# EAGLE design fascia_faceInterfaceV0.1 (EAGLE 9.6.0)
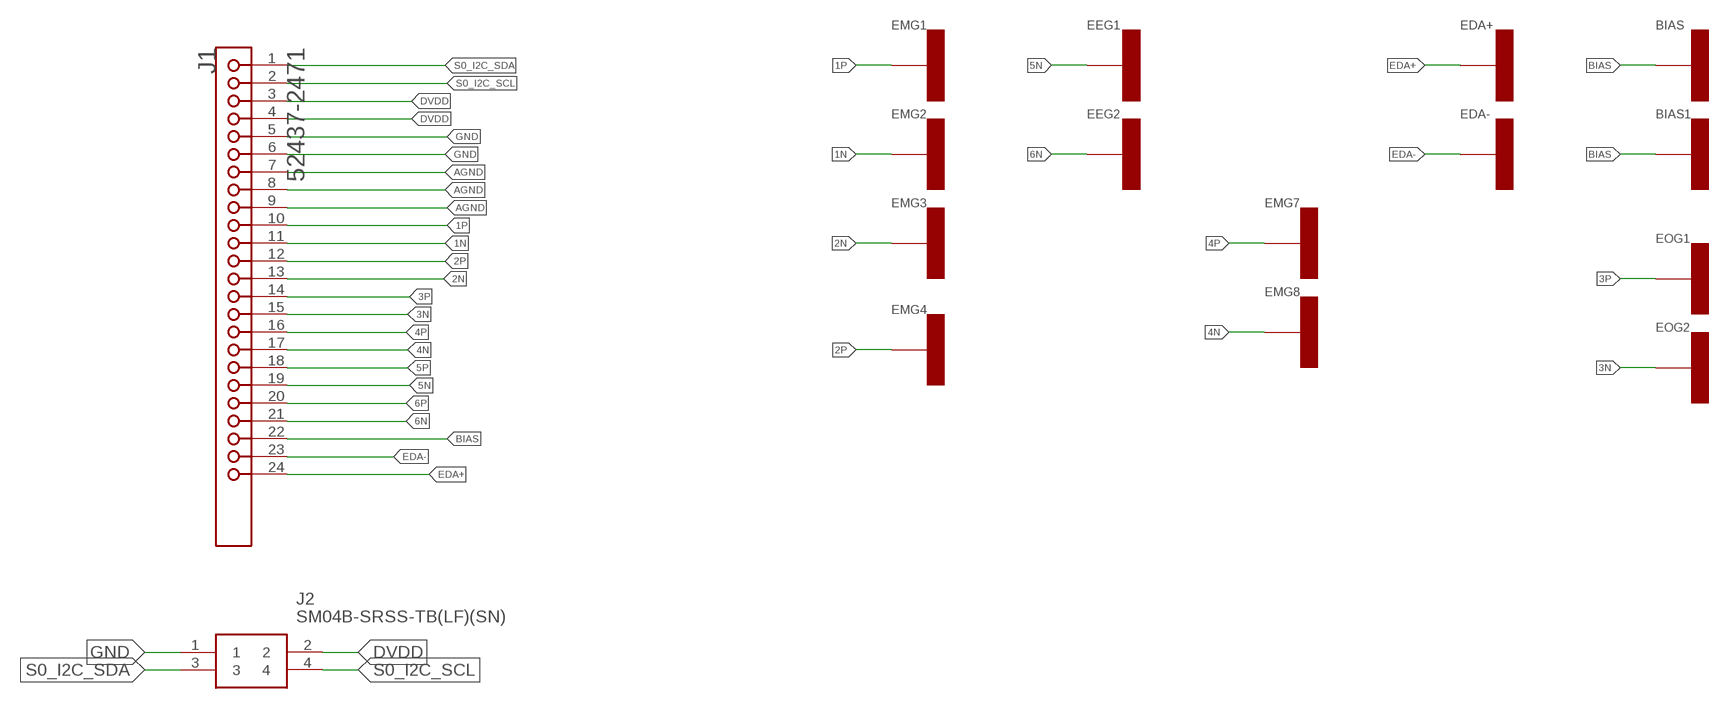
[diagram p0: schematic, sheet 1]

## Parts
BIAS  ELECTRODE-8MMELECTRODE_8MM  [ELECTRODE_V2]
BIAS1  ELECTRODE-8MMELECTRODE_8MM  [ELECTRODE_V2]
EDA+  ELECTRODE-8MMELECTRODE_8MM  [ELECTRODE_V2]
EDA-  ELECTRODE-8MMELECTRODE_8MM  [ELECTRODE_V2]
EEG1  ELECTRODE-8MMELECTRODE_8MM  [ELECTRODE_V2]
EEG2  ELECTRODE-8MMELECTRODE_8MM  [ELECTRODE_V2]
EMG1  ELECTRODE-8MMELECTRODE_8MM  [ELECTRODE_V2]
EMG2  ELECTRODE-8MMELECTRODE_8MM  [ELECTRODE_V2]
EMG3  ELECTRODE-8MMELECTRODE_8MM  [ELECTRODE_V2]
EMG4  ELECTRODE-8MMELECTRODE_8MM  [ELECTRODE_V2]
EMG7  ELECTRODE-8MMELECTRODE_8MM  [ELECTRODE_V2]
EMG8  ELECTRODE-8MMELECTRODE_8MM  [ELECTRODE_V2]
EOG1  ELECTRODE-8MMELECTRODE_8MM  [ELECTRODE_V2]
EOG2  ELECTRODE-8MMELECTRODE_8MM  [ELECTRODE_V2]
J1  MOLEX_52437-247_FLEX  [MOLEX_52437-2471_FLEX]
J2  SM04B-SRSS-TB(LF)(SN)  [SM04B-SRSS-TB(LFSN)]

## Nets
1N: EMG2., EMG2.. EMG2.P$1 EMG2.P$2 EMG2.P$3 EMG2.P$4 J1.11
1P: EMG1., EMG1.. EMG1.P$1 EMG1.P$2 EMG1.P$3 EMG1.P$4 J1.10
2N: EMG3., EMG3.. EMG3.P$1 EMG3.P$2 EMG3.P$3 EMG3.P$4 J1.13
2P: EMG4., EMG4.. EMG4.P$1 EMG4.P$2 EMG4.P$3 EMG4.P$4 J1.12
3N: EOG2., EOG2.. EOG2.P$1 EOG2.P$2 EOG2.P$3 EOG2.P$4 J1.15
3P: EOG1., EOG1.. EOG1.P$1 EOG1.P$2 EOG1.P$3 EOG1.P$4 J1.14
4N: EMG8., EMG8.. EMG8.P$1 EMG8.P$2 EMG8.P$3 EMG8.P$4 J1.17
4P: EMG7., EMG7.. EMG7.P$1 EMG7.P$2 EMG7.P$3 EMG7.P$4 J1.16
5N: EEG1., EEG1.. EEG1.P$1 EEG1.P$2 EEG1.P$3 EEG1.P$4 J1.19
5P: J1.18
6N: EEG2., EEG2.. EEG2.P$1 EEG2.P$2 EEG2.P$3 EEG2.P$4 J1.21
6P: J1.20
AGND: J1.7 J1.8 J1.9
BIAS: BIAS1., BIAS1.. BIAS1.P$1 BIAS1.P$2 BIAS1.P$3 BIAS1.P$4 BIAS., BIAS.. BIAS.P$1 BIAS.P$2 BIAS.P$3 BIAS.P$4 J1.22
DVDD: J1.3 J1.4 J2.2
EDA+: EDA+., EDA+.. EDA+.P$1 EDA+.P$2 EDA+.P$3 EDA+.P$4 J1.24
EDA-: EDA-., EDA-.. EDA-.P$1 EDA-.P$2 EDA-.P$3 EDA-.P$4 J1.23
GND: J1.5 J1.6 J2.1
S0_I2C_SCL: J1.2 J2.4
S0_I2C_SDA: J1.1 J2.3

## Library data of the parts
BIAS BIAS1 EDA+ EDA- EEG1 EEG2 EMG1-EMG4 EMG7 EMG8 EOG1 EOG2 = novaXR:ELECTRODE-8MM
J1 = Molex - 52437-2471:MOLEX_52437-247_FLEX: MOLX-52437-2471
J2 = SamacSys_Parts:SM04B-SRSS-TB(LF)(SN): JST (JAPAN SOLDERLESS TERMINALS) - SM04B-SRSS-TB(LF)(SN) - CONNECTOR, HEADER, SMT, R/A, 1MM, 4WAY Source: Datasheet; DESCRIPTION: JST (JAPAN SOLDERLESS TERMINALS) - SM04B-SRSS-TB(LF)(SN) - CONNECTOR, HEADER, SMT, R/A, 1MM, 4WAY; HEIGHT: mm; MANUFACTURER_NAME: JST (JAPAN SOLDERLESS TERMINALS); MANUFACTURER_PART_NUMBER: SM04B-SRSS-TB(LF)(SN)

## Net classes
0 default: width 0.19 mm, drill 0.19 mm

## Board
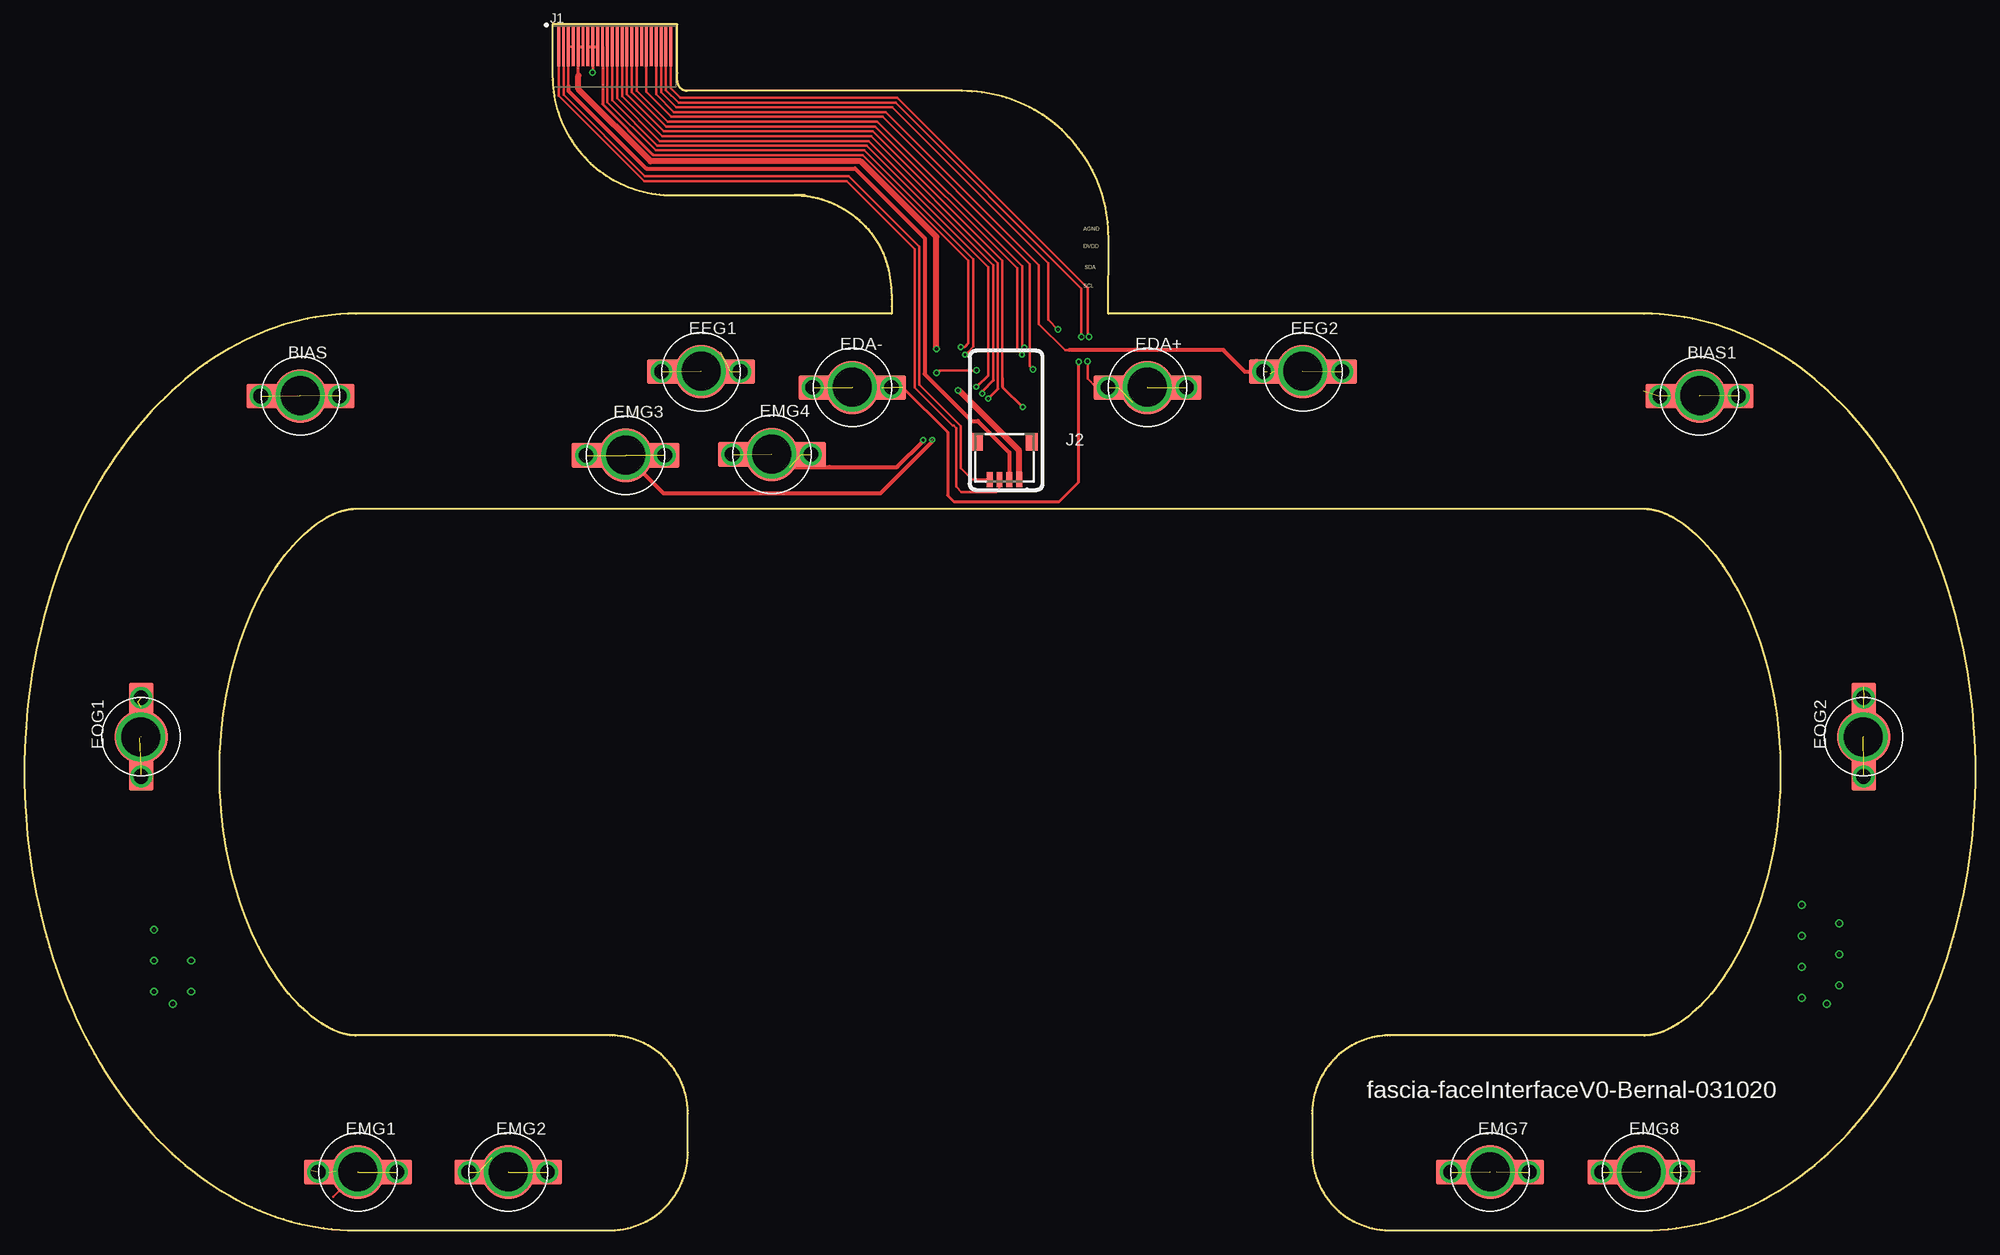
[diagram p1: board, top side]
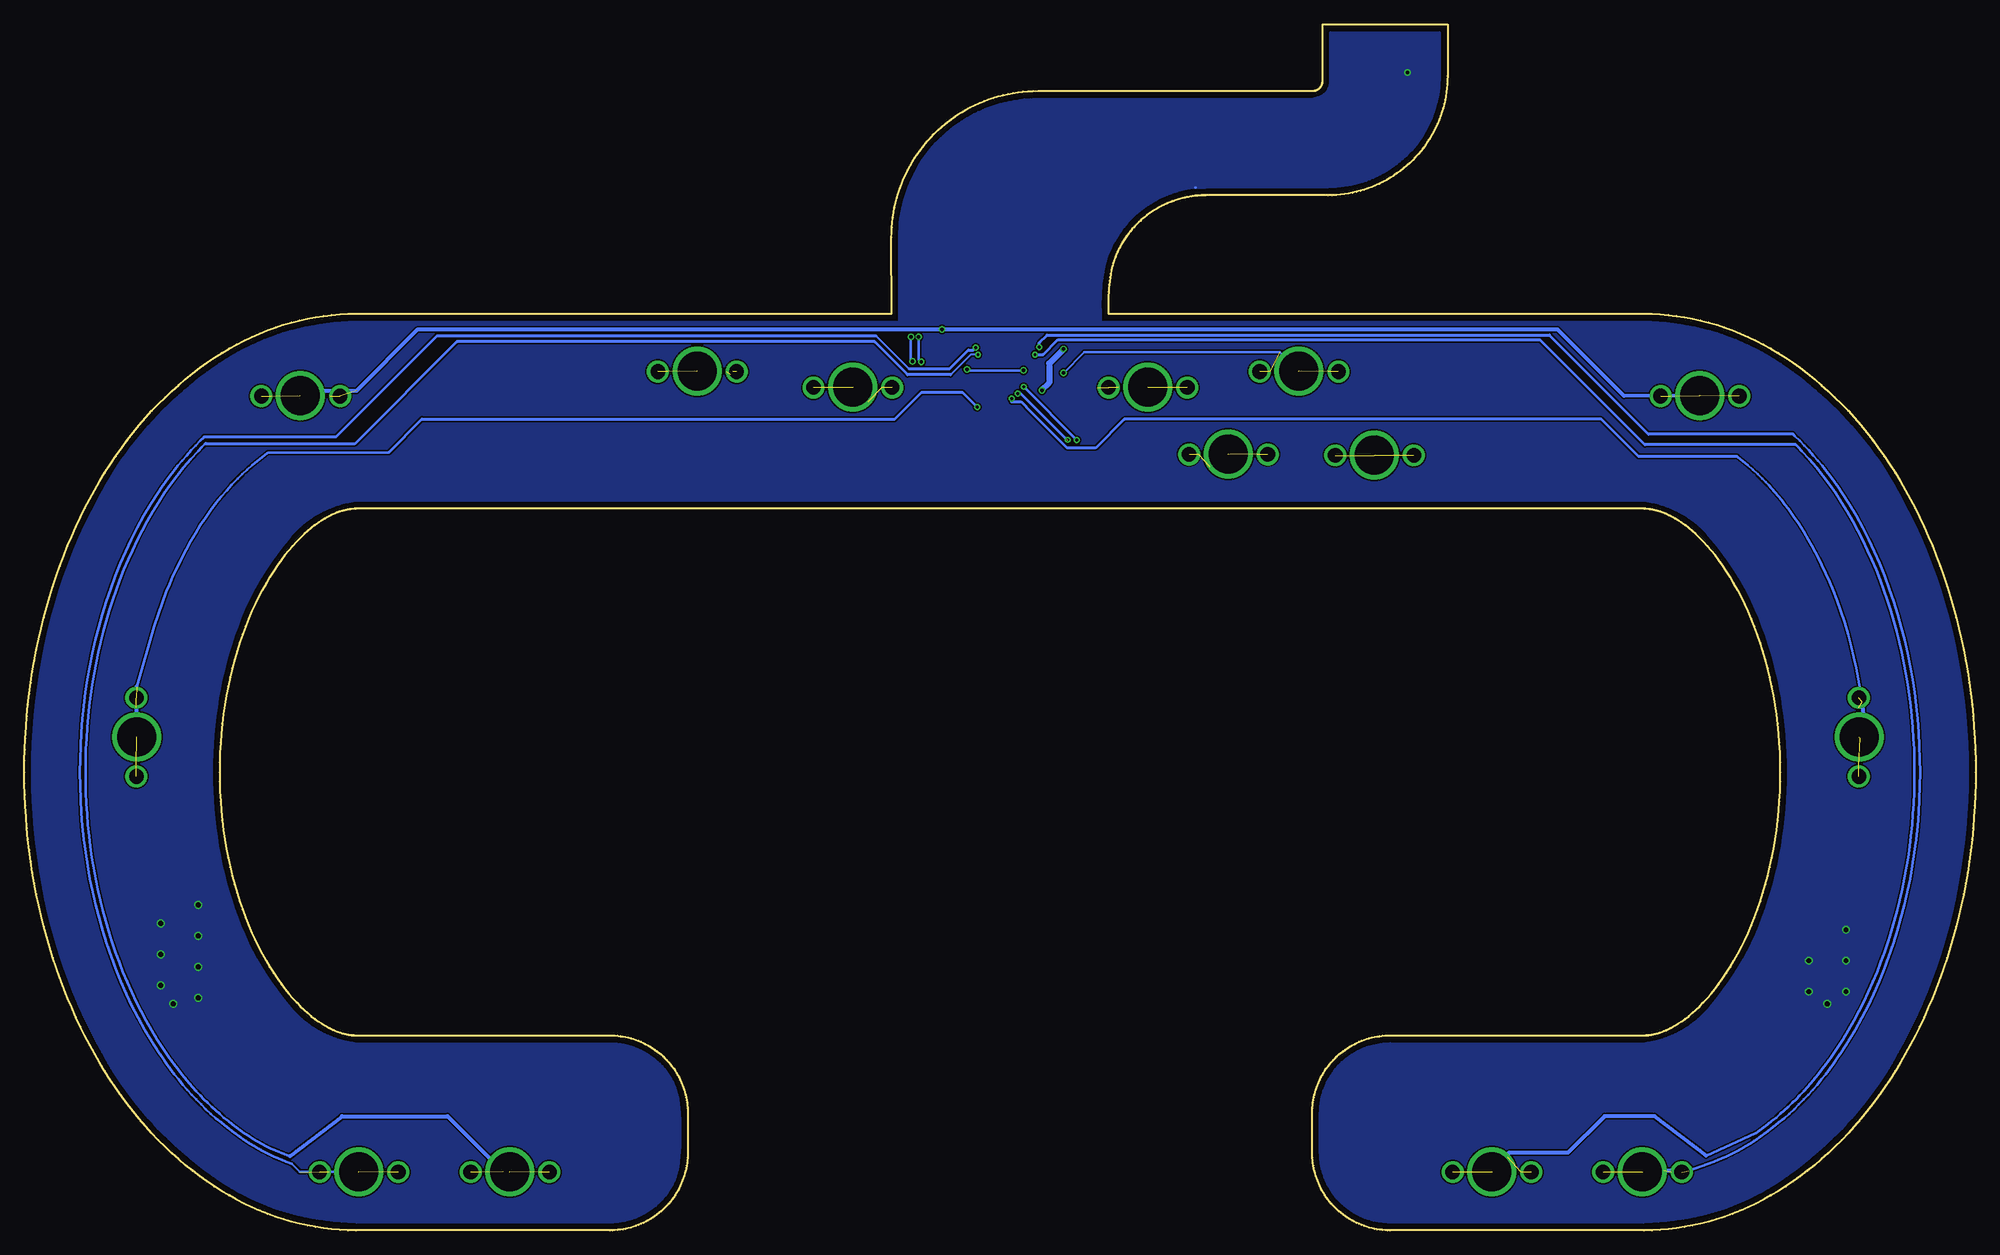
[diagram p2: board, bottom side, seen from below]

Size 200 x 123.67 mm. Coordinates in mm from the lower left corner, seen from the top.
Outline: 958 segments
Copper layers (1*16): Top 0.035mm / dielectric 1.5mm / Bottom 0.035mm
Design rules "SparkFun-2-layer-PCBWay-LIMIT": minimum track width 6mil, minimum drill 0.3mm, track to track 6mil, track to pad 6mil, pad to pad 6mil, via to via 6mil, smd to smd 6mil, copper to edge 6mil, drill to drill 6mil, minimum pad ring 6mil, minimum via ring 6mil, stop-mask expansion 4mil, vias tented up to drill 25mil, thermal gap 10mil

### Footprints (pad centres in the part's own frame; a part is rotated, then mirrored left to right if it is on the bottom)
ELECTRODE_V2 = drill 4 pad 4.1: , 0,0.04 | smd 5.5 x 5.5: . 0,0 | drill 1.5 pad 1.676: P$1 -4.056,0; P$2 4.009,0 | smd 5.08 x 2.54: P$3 -3,0; P$4 3,0
MOLEX_52437-2471_FLEX = smd 0.3 x 4: 1 0.15,2; 2 0.65,2; 3 1.15,2; 4 1.65,2; 5 2.15,2; 6 2.65,2; 7 3.15,2; 8 3.65,2; 9 4.15,2; 10 4.65,2; 11 5.15,2; 12 5.65,2; 13 6.15,2; 14 6.65,2; 15 7.15,2; 16 7.65,2; 17 8.15,2; 18 8.65,2; 19 9.15,2; 20 9.65,2; 21 10.15,2; 22 10.65,2; 23 11.15,2; 24 11.65,2
SM04B-SRSS-TB(LFSN) = smd 0.6 x 1.55: 1 1.5,4.661; 2 2.5,4.661; 3 3.5,4.661; 4 4.5,4.661 | smd 1.2 x 1.8: 5 0.2,0.786; 6 5.8,0.786

### Placement (x,y rotation side)
BIAS  28.28,85.56 0 top
BIAS1  171.7,85.56 0 top
EDA+  115.11,86.44 0 top
EDA-  84.86,86.44 0 top
EEG1  69.36,88.06 0 top
EEG2  131.05,88.06 0 top
EMG1  34.18,5.98 0 top
EMG2  49.6,5.98 0 top
EMG3  61.63,79.48 0 top
EMG4  76.61,79.58 0 top
EMG7  150.24,5.98 0 top
EMG8  165.73,5.98 0 top
EOG1  11.97,50.61 90 top
EOG2  188.53,50.61 90 top
J1  54.61,119.38 0 top
J2  103.46,81.63 180 top

### Tracks (layer width: path | path; a pad name or v marks a point on that pad's centre or on a via)
1N  (via drill 0.3)  (5 unrouted)
  Top 0.25: 97.26,95.14 97.26,90.61 96.73,90.08
  Top 0.254: 96.73,90.08 96.46,89.81 v96.41,89.81 | 97.26,95.14 97.26,99.58 86.1,110.74 64.7,110.74 59.76,115.68 J1.11
  Bottom 0.25: 18.35,80.5 18.19,80.34 17.81,79.93 17.06,79.11 16.35,78.27 15.66,77.4 14.99,76.51 14.36,75.6 13.75,74.67 13.17,73.72 12.61,72.76 12.08,71.78 11.57,70.79 11.09,69.79 10.63,68.77 10.2,67.75 9.79,66.72 9.41,65.67 9.04,64.62 8.71,63.56 8.39,62.5 8.1,61.43 7.82,60.35 7.58,59.26 7.35,58.18 7.14,57.08 6.96,55.99 6.8,54.89 6.66,53.78 6.54,52.68 6.44,51.57 6.37,50.46 6.31,49.35 6.28,48.24 6.27,47.13 6.27,46.02 6.3,44.91 6.35,43.8 6.43,42.69 6.52,41.58 6.63,40.47 6.77,39.37 6.92,38.27 7.1,37.17 7.3,36.08 7.52,34.99 7.76,33.91 8.03,32.83 8.32,31.75 8.63,30.69 8.96,29.63 9.32,28.57 9.7,27.53 10.1,26.49 10.53,25.47 10.98,24.45 11.46,23.44 11.96,22.45 12.48,21.47 13.03,20.5 13.61,19.55 14.21,18.62 14.84,17.71 15.5,16.81 16.18,15.94 16.89,15.08 17.63,14.26 18.01,13.85 18.4,13.45 18.8,13.06 19.2,12.68 19.61,12.3 20.02,11.93 20.45,11.57 20.88,11.22 21.29,10.89 21.71,10.58 22.13,10.27 22.56,9.97 22.59,9.95 27.61,7.66
  Bottom 0.305: v96.41,89.81 95.59,89.81 94.06,91.34 44.66,91.34 33.89,80.57 18.43,80.57 18.35,80.5
  Bottom 0.406: 27.61,7.66 32.91,11.72 38.03,11.72 41.76,7.99 47.78,7.99 47.95,7.81 47.95,7.49 EMG2.,
1P  (via drill 0.3)  (5 unrouted)
  Top 0.203: 96.42,90.65 96.34,90.56 v95.97,90.56
  Top 0.25: 96.42,90.65 96.74,90.97 96.74,94.99 96.74,95.14 | 31.64,3.44 EMG1.,
  Top 0.254: 96.74,94.99 96.73,95 | 96.74,95.14 96.74,99.45 85.91,110.28 64.48,110.28
  Top 0.305: J1.10 59.26,115.49 64.48,110.28
  Bottom 0.25: 29.42,6.1 26.83,7.04 26.27,7.27 25.63,7.55 25,7.85 24.38,8.18 23.77,8.52 23.17,8.88 22.58,9.26 22.01,9.65 21.44,10.06 20.79,10.55 20.16,11.06 19.64,11.51 19.12,11.97 18.61,12.44 18.12,12.93 17.64,13.42 17.16,13.92 16.7,14.43 16.25,14.95 15.81,15.48 15.39,16.02 14.97,16.56 14.56,17.12 14.16,17.68 13.77,18.24 13.03,19.4 12.32,20.59 11.65,21.79 11.02,23.02 10.43,24.27 9.88,25.53 9.36,26.8 8.88,28.09 8.44,29.39 8.03,30.7 7.65,32.02 7.31,33.35 7,34.69 6.72,36.03 6.48,37.39 6.27,38.74 6.1,40.1 5.95,41.47 5.84,42.84 5.76,44.21 5.71,45.58 5.69,46.95 5.71,48.32 5.75,49.69 5.83,51.06 5.94,52.42 6.08,53.78 6.26,55.14 6.46,56.49 6.7,57.84 6.97,59.18 7.28,60.52 7.61,61.84 7.99,63.17 8.4,64.49 8.84,65.79 9.32,67.08 9.83,68.36 10.38,69.61 10.96,70.86 11.59,72.08 12.25,73.29 12.96,74.48 13.7,75.65 14.09,76.22 14.49,76.78 14.89,77.34 15.31,77.89 15.74,78.42 16.17,78.96 16.62,79.48 17.08,79.99 17.55,80.49 18.03,80.99 18.53,81.48 18.71,81.64
  Bottom 0.305: 31.97,6.1 32.78,6.1 | 18.71,81.64 33.54,81.64 43.7,91.81 95.18,91.81 95.97,91.02 v95.97,90.56 | 34.06,6.1 EMG1.,
  Bottom 0.406: 29.42,6.1 31.97,6.1 34.06,6.1
2N  (via drill 0.3)  (6 unrouted)
  Top 0.203: 98.14,86 98.2,85.94 v98.2,85.8
  Top 0.25: 99.33,94.3 99.33,87.17
  Top 0.254: J1.13 60.76,116.08 65.12,111.71 86.57,111.71 99.33,98.95 99.33,94.3
  Top 0.305: 99.33,87.17 98.16,86 98.14,86 | 93.11,81.08 93.07,81.08 v93.05,81.06
  Top 0.406: 93.08,80.98 93.12,80.94 87.74,75.56 65.55,75.56 EMG3..
  Bottom 0.203: v98.2,85.8 98.07,85.93 97.99,85.93 | v93.05,81.06 93.13,81.06
  Bottom 0.305: 93.13,81.06 97.99,85.93
2P  (via drill 0.3)  (5 unrouted)
  Top 0.203: 97.63,86.5 v97.58,86.5
  Top 0.25: 98.78,87.65 98.78,95.11 | 92.13,80.95 v92.13,81.03 92.13,80.96
  Top 0.254: 82.51,78.28 77.95,78.28 EMG4., | J1.12 60.26,115.88 64.89,111.25 86.33,111.25 98.78,98.8 98.78,95.11
  Top 0.305: 98.78,87.65 97.63,86.5
  Top 0.406: 77.24,79.48 78.43,78.28 82.51,78.28 89.48,78.28 89.48,78.31 92.13,80.96
  Bottom 0.203: 92.13,81.06 v92.13,81.03
  Bottom 0.305: v97.58,86.5 92.13,81.06
3N  (via drill 0.3)  (5 unrouted)
  Top 0.25: 100.25,95.14 100.25,87.37
  Top 0.254: J1.15 61.76,116.52 65.56,112.72 86.98,112.72 100.25,99.44 100.25,95.14
  Top 0.305: 100.25,87.37 100.25,86.48 v102.32,84.41
  Bottom 0.25: 162.67,79.77 175,79.77 175.08,79.71 175.62,79.32 176.15,78.91 176.67,78.47 177.18,78.03 177.67,77.56 178.16,77.09 178.73,76.49 179.28,75.88 179.81,75.25 180.33,74.61 180.89,73.86 181.43,73.1 181.95,72.32 182.45,71.52 182.95,70.68 183.42,69.82 184.03,68.65 184.41,67.87 184.77,67.09 185.11,66.29 185.44,65.49 185.89,64.32 186.3,63.14 186.68,61.95 188.49,55.73
  Bottom 0.305: 162.67,79.77 159.25,83.2 110.8,83.18 108.03,85.95 103.86,85.95 v102.32,84.41
  Bottom 0.406: EOG2., 188.49,55.73
3P  (via drill 0.3)  (5 unrouted)
  Top 0.25: 99.79,86.29 99.79,95.1
  Top 0.254: J1.14 61.26,116.29 65.36,112.19 86.81,112.19 99.79,99.2 99.79,95.1
  Top 0.305: 99.79,86.29 98.81,85.32
  Top 0.406: 98.81,85.32 v98.81,85.29
  Bottom 0.25: 11.64,54.19 11.82,55.41 12.01,56.53 12.23,57.65 12.47,58.77 12.74,59.88 13.07,61.1 13.43,62.31 13.82,63.51 14.25,64.7 14.6,65.6 14.97,66.49 15.36,67.37 15.76,68.24 16.09,68.9 16.43,69.56 16.78,70.21 17.15,70.85 17.64,71.66 18.14,72.46 18.67,73.25 19.23,74.02 19.55,74.45 19.88,74.88 20.22,75.29 20.57,75.71 21.2,76.41 21.52,76.75 21.84,77.09 22.33,77.56 22.82,78.03 23.33,78.47 23.85,78.91 24.38,79.32 24.45,79.37
  Bottom 0.305: 24.45,79.37 34.55,79.37 38.36,83.18 87.25,83.18 90.19,80.25 93.1,80.25 97.34,84.49 97.33,84.49 97.83,84.98 98.81,84.98 v98.81,85.29 | EOG1., 11.82,50.51 11.26,50.51
  Bottom 0.406: 11.26,50.51 11.36,51.74 11.48,52.96 11.64,54.19
4N  (via drill 0.3)  (5 unrouted)
  Top 0.25: v102.48,90.53 102.26,90.75 102.26,94.95 102.26,95.14
  Top 0.254: J1.17 62.76,116.88 65.97,113.67 87.44,113.67 102.26,98.86 102.26,94.95
  Bottom 0.25: 172.6,6.84 173.17,7.04 173.73,7.27 174.37,7.55 175,7.85 175.62,8.18 176.23,8.52 176.83,8.88 177.42,9.26 177.99,9.65 178.56,10.06 179.21,10.55 179.84,11.06 180.37,11.51 180.88,11.97 181.39,12.44 181.88,12.93 182.36,13.42 182.84,13.92 183.3,14.43 183.75,14.95 184.19,15.48 184.62,16.02 185.03,16.56 185.44,17.12 185.84,17.68 186.23,18.24 186.97,19.4 187.68,20.59 188.35,21.79 188.98,23.02 189.57,24.27 190.12,25.53 190.64,26.8 191.12,28.09 191.56,29.39 191.97,30.7 192.35,32.02 192.69,33.35 193,34.69 193.28,36.03 193.52,37.39 193.73,38.74 193.9,40.1 194.05,41.47 194.16,42.84 194.24,44.21 194.29,45.58 194.31,46.95 194.29,48.32 194.25,49.69 194.17,51.06 194.06,52.42 193.92,53.78 193.74,55.14 193.54,56.49 193.3,57.84 193.03,59.18 192.73,60.52 192.39,61.84 192.01,63.17 191.61,64.49 191.16,65.79 190.68,67.08 190.17,68.36 189.62,69.61 189.04,70.86 188.41,72.08 187.75,73.29 187.04,74.48 186.3,75.65 185.91,76.22 185.51,76.78 185.11,77.34 184.69,77.89 184.26,78.42 183.83,78.96 183.38,79.48 182.92,79.99 182.45,80.49 181.97,80.99 181.58,81.37 | 112.71,91.72 109.35,88.37
  Bottom 0.254: EMG8., 171.79,6.02 172.6,6.84
  Bottom 0.305: 112.71,91.72 157.73,91.72 168.08,81.37 181.58,81.37 | v102.48,90.53 102.74,90.27 103.25,90.27 105.15,88.37 109.35,88.37
4P  (via drill 0.3)  (5 unrouted)
  Top 0.203: 102.21,89.82 102.25,89.87 v102.25,89.8 | 101.72,95.03 101.76,94.99
  Top 0.25: 101.76,95.14 101.76,94.99 101.76,90.27 102.21,89.82
  Top 0.254: J1.16 62.26,116.71 65.77,113.2 87.21,113.2 101.76,98.65 101.76,94.99
  Bottom 0.203: 105.07,87.74 103.01,89.8 v102.25,89.8
  Bottom 0.25: 181.42,80.72 181.51,80.64 181.81,80.34 182.19,79.93 182.94,79.11 183.65,78.27 184.34,77.4 185.01,76.51 185.64,75.6 186.25,74.67 186.83,73.72 187.39,72.76 187.92,71.78 188.43,70.79 188.91,69.79 189.37,68.77 189.8,67.75 190.21,66.72 190.59,65.67 190.96,64.62 191.3,63.56 191.61,62.5 191.9,61.43 192.18,60.35 192.42,59.26 192.65,58.18 192.86,57.08 193.04,55.99 193.2,54.89 193.34,53.78 193.46,52.68 193.56,51.57 193.63,50.46 193.69,49.35 193.72,48.24 193.73,47.13 193.73,46.02 193.7,44.91 193.65,43.8 193.58,42.69 193.48,41.58 193.37,40.47 193.23,39.37 193.08,38.27 192.81,36.62 192.48,34.99 192.24,33.91 191.97,32.83 191.68,31.75 191.37,30.69 191.04,29.63 190.68,28.57 190.3,27.53 189.9,26.49 189.47,25.47 189.02,24.45 188.54,23.44 188.04,22.45 187.52,21.47 186.97,20.5 186.39,19.55 185.79,18.62 185.16,17.71 184.5,16.81 183.82,15.94 183.11,15.08 182.37,14.26 181.99,13.85 181.6,13.45 181.2,13.06 180.8,12.68 180.39,12.3 179.98,11.93 179.55,11.57 179.12,11.22 178.71,10.89 178.3,10.58 177.87,10.27 177.44,9.97 177.01,9.68 176.57,9.4 176.12,9.12 175.67,8.86 175.22,8.61 174.81,8.4 172.79,7.61
  Bottom 0.305: EMG7., 150.93,6.02 | 105.07,87.74 109.46,87.74 112.84,91.12 155.68,91.12 166.16,80.64 181.51,80.64
  Bottom 0.406: 172.79,7.61 167.42,11.72 156.63,11.72 150.93,6.02
5N  (via drill 0.35)  (5 unrouted)
  Top 0.254: v93.49,87.92 93.75,88.19 v97.6,88.19 | v103.38,88.29 103.07,88.6 103.07,99.1 87.96,114.2 66.3,114.2 63.76,116.74 J1.19
  Bottom 0.254: EEG1., 71.32,90.06 91.35,90.06 v93.49,87.92 | v97.6,88.19 103.27,88.19 v103.38,88.29
6N  (5 unrouted)
  Top 0.254: J1.21 64.76,116.48 66.58,114.66 88.28,114.66 103.99,98.96 103.99,92.95 106.67,90.27 107.15,90.27
  Top 0.305: EEG2.. 127.38,88.06 126.29,89.14
  Top 0.406: 107.15,90.27 122.88,90.27 125.12,88.04 127.4,88.04 | 127.63,87.8 127.4,88.04 | 127.4,88.04 126.29,89.14
AGND  (via drill 0.35, 0.5)
  Top 0.305: J1.7 J1.8 | J1.8 J1.9 | J1.8 58.26,118.75 v58.25,118.74
  Bottom 0.2: 80.03,106.94 79.9,106.94
  other vias: 186.01,31.47 186.01,28.29 186.01,25.12 184.74,23.21 182.2,23.85 182.2,27.02 182.2,30.2 182.2,33.37 17.1,27.66 17.1,24.48 15.19,23.21 13.29,24.48 13.29,27.66 13.29,30.83
  pour Bottom: 1006 corners
BIAS  (via drill 0.35)  (10 unrouted)
  Top 0.254: J1.22 65.26,116.71 66.79,115.17 88.95,115.17 104.94,99.19 104.94,93.37 105.93,92.38 v105.93,92.4
  Bottom 0.406: BIAS., 36.02,85.56 42.88,92.41 94.71,92.41 94.73,92.4 v105.93,92.4 159.67,92.4 165.96,86.11 171.15,86.11 BIAS1.,
DVDD
  Top 0.254: J1.4 J1.3 55.76,117.38 55.77,117.38
  Top 0.406: 55.77,117.38 55.77,116.88 63.75,108.89 85.15,108.89 92.28,101.76 92.28,87.81 97.1,83 97.74,83 100.96,79.78 J2.2
EDA+  (via drill 0.35)  (5 unrouted)
  Top 0.25: EDA+., 113.55,84.93
  Top 0.254: J1.24 66.26,117.11 67.25,116.12 89.46,116.12 108.97,96.61 108.97,91.79 v109.14,91.62 | EDA+.P$3 109.88,86.44 108.99,87.33 v108.99,89.12
  Bottom 0.254: v108.99,89.12 109.14,89.28 v109.14,91.62
EDA-  (via drill 0.35)  (5 unrouted)
  Top 0.254: J1.23 65.76,116.91 67.05,115.62 89.3,115.62 108.33,96.58 v108.33,91.62
  Top 0.305: EDA-.. 90.04,86.44 94.64,81.85 94.64,75.36 95.27,74.73 106.07,74.73 108.07,76.73 v108.07,89.05
  Bottom 0.254: v108.33,91.62 108.33,89.31 v108.07,89.05
GND  (via drill 0.35)
  Top 0.305: 56.8,118.41 56.8,121.35 J1.5 J1.6
  Top 0.61: v95.71,86.16 95.76,86.16 101.96,79.96 J2.1 | 56.8,118.41 56.8,117.03 64.19,109.64 85.73,109.64 93.49,101.88 v93.49,90.37
  Bottom 0.61: v93.49,90.37 94.97,88.9 94.97,86.9 v95.71,86.16
S0_I2C_SCL
  Top 0.254: J2.4 97.18,76.97 95.98,78.16 95.98,82.47 91.74,86.71 91.74,100.88 84.5,108.12 63.61,108.12 55.26,116.47 J1.2
S0_I2C_SDA
  Top 0.254: J1.1 54.77,121.37 54.77,116.35 63.53,107.58 84.29,107.58 91.26,100.62 91.26,86.44 95.18,82.52 95.25,82.52 95.51,82.26 95.51,76.25 96.04,75.72 99.63,75.72 99.94,76.04 99.94,76.96 J2.3

### Text on the board
tNames: AGND | DVDD | SDA | SCL | fascia-faceInterfaceV0-Bernal-031020
bStiffener: stiffener BOT | stiffener BOT